# Altium schematic sheet Res_Led.SchDoc
size A4; SheetNumber: 2; SheetTotal: 2
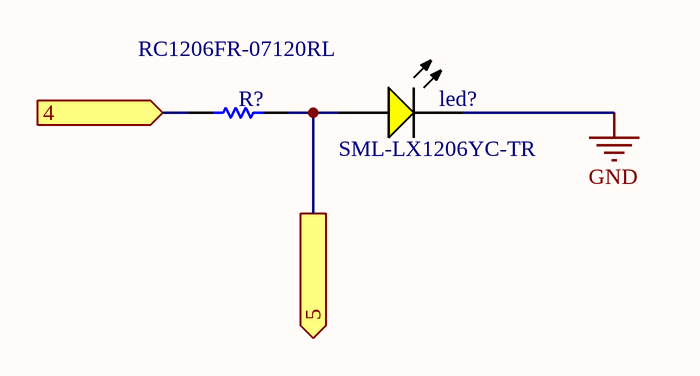
[diagram p0: Res_Led.SchDoc]

## Parts
led?  SML-LX1206YC-TR  [LUMX-SML-LX1206YC-TR_V]
R?  RC1206FR-07120RL  [RESC3116X65X40LL10T20]

## Ports
4 (in), 5 (out)

## Nets
GND: led?.2(K)
4: R?.1 ; port 4
5: led?.1(A) R?.2 ; port 5

## Library data of the parts
led? = CMP-2000-07124-1: Yellow LED, Water Clear Len, 585 nm, 2.1 V, -40 to 85 degC, 2-Pin SMD, RoHS, Tape and Reel; Manufacturer: Lumex; Product Training Modules: LEDsBenefitsofCustomLEDandLCDTechnology; Millicandela Rating: 6mcd; Catalog Drawings: SML-LX1206SeriesTopSML-LX1206SeriesSideSML-LX1206SeriesBottomSML-LX1206SeriesFootprint; Wavelength - Peak: 585nm; Other Names: 67-1358-2LU60357TRSMLLX1206YCTR; Lens Style/Size: RectanglewithFlatTop; Current - Test: 20mA; Lens Color: Colorless; Viewing Angle: 160°; Voltage - Forward (Vf) (Typ): 2.1V; Online Catalog: SML-LX1206RectanglewithFlatTop1206PackageLEDs; Mounting Type: SurfaceMount; Package Description: 2-Pin Surface Mount Device, Body 3.2 x 1.5 mm; Datasheet Version: Rev. K, 08/2012; Features: -; Color: Yellow; RoHS Information: RoHSCertofCompliance; Package Reference: SML-LX1206YC-TR; Supplier Device Package: 1206; Standard Package: 3,000; Series: -; Wavelength - Dominant: -; Package / Case: 1206(3216Metric); Mounting Technology: SurfaceMount; Height (Max): 1.10mm; Lens Transparency: Clear; Datasheet URL: http://www.lumex.com/content/files/ProductAttachment/SML-LX1206YC-TR.pdf; Family: LEDIndication-Discrete; Manufacturer URL: http://www.lumexinstruments.com/; Packaging: Tape&Reel(TR); Category: Optoelectronics; Size / Dimension: 3.20mmLx1.60mmW
R? = CMP-2000-06965-1: Chip Resistor, 120 Ohm, +/- 1%, 250 mW, -55 to 155 degC, 1206 (3216 Metric), RoHS, Tape and Reel; Manufacturer: Yageo; Resistor Element Type: ThickFilm; Resistance: 120ohm; Voltage Rating: 200V; Temperature Coefficient: ±100ppm/°C; Power Rating: 250mW; Product Range: RCSeries; SVHC: ToBeAdvised; Resistor Case Style: 1206[3216Metric]; Package Reference: 1206; Resistance Tolerance: ±1%; Package Description: 2-Pin Surface Mount Device, Body 3.1 x 1.6 mm; Manufacturer URL: http://www.yageo.com/; MSL: MSL1-Unlimited; Packaging: CutTape; Datasheet URL: http://www.yageo.com/documents/recent/PYu-RC_Group_51_RoHS_L_7.pdf; Mounting Technology: SurfaceMount; Datasheet Version: Rev. 7, 05/2017